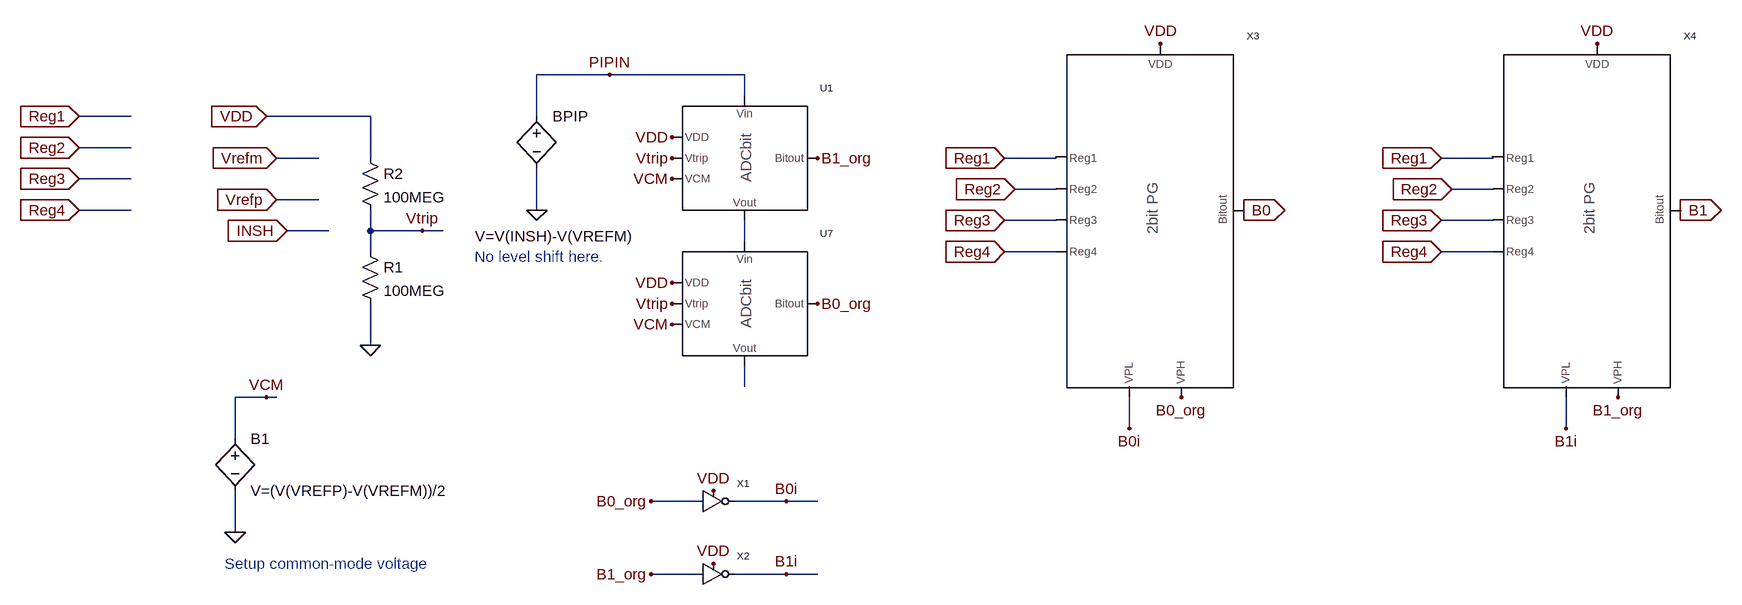
[diagram p0: schematic 2_bit_fine_ADC_LSB.asc]
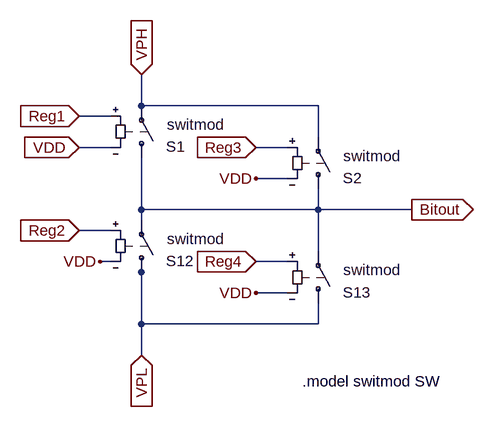
[diagram p1: sub-circuit 2bit_pg.asc]
2_bit_fine_ADC_LSB.asc, the LTspice schematic file:
Version 4
SHEET 1 4400 868
WIRE 800 -1120 688 -1120
WIRE 1008 -1120 800 -1120
WIRE 1008 -1088 1008 -1120
WIRE 64 -1056 -16 -1056
WIRE 432 -1056 272 -1056
WIRE 688 -1056 688 -1120
WIRE 64 -1008 -16 -1008
WIRE 352 -992 288 -992
WIRE 432 -992 432 -1056
WIRE 1488 -992 1408 -992
WIRE 2160 -992 2080 -992
WIRE 64 -960 -16 -960
WIRE 1488 -944 1424 -944
WIRE 2160 -944 2096 -944
WIRE 352 -928 288 -928
WIRE 64 -912 -16 -912
WIRE 688 -912 688 -976
WIRE 1488 -896 1408 -896
WIRE 2160 -896 2080 -896
WIRE 368 -880 304 -880
WIRE 432 -880 432 -912
WIRE 512 -880 432 -880
WIRE 544 -880 512 -880
WIRE 1008 -864 1008 -896
WIRE 432 -848 432 -880
WIRE 1488 -848 1408 -848
WIRE 2160 -848 2080 -848
WIRE 432 -704 432 -768
WIRE 1008 -640 1008 -672
WIRE 272 -624 224 -624
WIRE 288 -624 272 -624
WIRE 1600 -576 1600 -624
WIRE 2272 -576 2272 -624
WIRE 224 -560 224 -624
WIRE 944 -464 864 -464
WIRE 1072 -464 992 -464
WIRE 1120 -464 1072 -464
WIRE 224 -416 224 -480
WIRE 944 -352 864 -352
WIRE 1072 -352 992 -352
WIRE 1120 -352 1072 -352
FLAG 512 -880 Vtrip
FLAG 432 -704 0
FLAG 272 -1056 VDD
IOPIN 272 -1056 In
FLAG 224 -416 0
FLAG 272 -624 VCM
FLAG 688 -912 0
FLAG 896 -992 Vtrip
FLAG 896 -1024 VDD
FLAG 896 -960 VCM
FLAG 896 -768 Vtrip
FLAG 896 -800 VDD
FLAG 896 -736 VCM
FLAG 1120 -768 B0_org
FLAG 800 -1120 PIPIN
FLAG 288 -992 Vrefm
IOPIN 288 -992 In
FLAG 288 -928 Vrefp
IOPIN 288 -928 In
FLAG 1120 -992 B1_org
FLAG 304 -880 INSH
IOPIN 304 -880 In
FLAG -16 -1056 Reg1
IOPIN -16 -1056 In
FLAG -16 -1008 Reg2
IOPIN -16 -1008 In
FLAG -16 -960 Reg3
IOPIN -16 -960 In
FLAG -16 -912 Reg4
IOPIN -16 -912 In
FLAG 864 -464 B0_org
FLAG 960 -480 VDD
FLAG 1072 -464 B0i
FLAG 864 -352 B1_org
FLAG 960 -368 VDD
FLAG 1072 -352 B1i
FLAG 1648 -1168 VDD
FLAG 1408 -992 Reg1
IOPIN 1408 -992 In
FLAG 1424 -944 Reg2
IOPIN 1424 -944 In
FLAG 1408 -896 Reg3
IOPIN 1408 -896 In
FLAG 1408 -848 Reg4
IOPIN 1408 -848 In
FLAG 2320 -1168 VDD
FLAG 1680 -624 B0_org
FLAG 1600 -576 B0i
FLAG 2272 -576 B1i
FLAG 2352 -624 B1_org
FLAG 2448 -912 B1
IOPIN 2448 -912 Out
FLAG 1776 -912 B0
IOPIN 1776 -912 Out
FLAG 2080 -992 Reg1
IOPIN 2080 -992 In
FLAG 2096 -944 Reg2
IOPIN 2096 -944 In
FLAG 2080 -896 Reg3
IOPIN 2080 -896 In
FLAG 2080 -848 Reg4
IOPIN 2080 -848 In
SYMBOL res 416 -864 R0
SYMATTR InstName R1
SYMATTR Value 100MEG
SYMBOL res 416 -1008 R0
SYMATTR InstName R2
SYMATTR Value 100MEG
SYMBOL bv 224 -576 R0
SYMATTR InstName B1
SYMATTR Value V=(V(VREFP)-V(VREFM))/2
SYMBOL bv 688 -1072 R0
WINDOW 3 -95 200 Left 0
SYMATTR Value V=V(INSH)-V(VREFM)
SYMATTR InstName BPIP
SYMBOL ADCbit 864 -976 R0
SYMATTR InstName U1
SYMBOL ADCbit 864 -752 R0
SYMATTR InstName U7
SYMBOL inverter 944 -464 R0
SYMATTR InstName X1
SYMBOL inverter 944 -352 R0
SYMATTR InstName X2
SYMBOL 2bit_pg 1648 -848 R0
SYMATTR InstName X3
SYMBOL 2bit_pg 2320 -848 R0
SYMATTR InstName X4
TEXT 592 -840 Left 0 ;No level shift here.
TEXT 208 -368 Left 0 ;Setup common-mode voltage

2bit_pg.asc, the sub-circuit schematic file:
Version 4
SHEET 1 3216 696
WIRE 864 -1296 864 -1344
WIRE 1136 -1296 864 -1296
WIRE 816 -1280 768 -1280
WIRE 1136 -1248 1136 -1296
WIRE 816 -1232 768 -1232
WIRE 1088 -1232 1040 -1232
WIRE 1088 -1184 1040 -1184
WIRE 864 -1136 864 -1216
WIRE 1136 -1136 1136 -1168
WIRE 1136 -1136 864 -1136
WIRE 1280 -1136 1136 -1136
WIRE 864 -1120 864 -1136
WIRE 816 -1104 768 -1104
WIRE 1136 -1072 1136 -1136
WIRE 816 -1056 800 -1056
WIRE 1088 -1056 1040 -1056
WIRE 864 -1040 864 -1056
WIRE 1088 -1008 1040 -1008
WIRE 864 -960 864 -1040
WIRE 1136 -960 1136 -992
WIRE 1136 -960 864 -960
WIRE 864 -912 864 -960
FLAG 1280 -1136 Bitout
IOPIN 1280 -1136 Out
FLAG 864 -912 VPL
IOPIN 864 -912 In
FLAG 864 -1344 VPH
IOPIN 864 -1344 In
FLAG 768 -1232 VDD
IOPIN 768 -1232 In
FLAG 768 -1280 Reg1
IOPIN 768 -1280 In
FLAG 1040 -1184 VDD
FLAG 1040 -1232 Reg3
IOPIN 1040 -1232 In
FLAG 768 -1104 Reg2
IOPIN 768 -1104 In
FLAG 1040 -1056 Reg4
IOPIN 1040 -1056 In
FLAG 1040 -1008 VDD
FLAG 800 -1056 VDD
SYMBOL sw 864 -1200 M180
WINDOW 3 24 -12 Left 0
WINDOW 38 39 67 Left 0
WINDOW 0 38 33 Left 0
SYMATTR Value ""
SYMATTR SpiceModel switmod
SYMATTR InstName S1
SYMBOL sw 1136 -1152 M180
WINDOW 3 24 -12 Left 0
WINDOW 38 39 67 Left 0
WINDOW 0 38 33 Left 0
SYMATTR Value ""
SYMATTR SpiceModel switmod
SYMATTR InstName S2
SYMBOL sw 864 -1024 M180
WINDOW 3 24 -12 Left 0
WINDOW 38 39 67 Left 0
WINDOW 0 38 33 Left 0
SYMATTR Value ""
SYMATTR SpiceModel switmod
SYMATTR InstName S12
SYMBOL sw 1136 -976 M180
WINDOW 3 24 -12 Left 0
WINDOW 38 39 67 Left 0
WINDOW 0 38 33 Left 0
SYMATTR Value ""
SYMATTR SpiceModel switmod
SYMATTR InstName S13
TEXT 1112 -872 Left 0 !.model switmod SW

The netlist it stands for:
* 2_bit_fine_ADC_LSB.asc
R1 Vtrip 0 100MEG
R2 VDD Vtrip 100MEG
B1 VCM 0 V=(V(VREFP)-V(VREFM))/2
BPIP PIPIN 0 V=V(INSH)-V(VREFM)
XU1 VDD Vtrip VCM PIPIN B1_org N001 ADCbit  ; pins VDD Vtrip VCM Vin Bitout Vout
XU7 VDD Vtrip VCM N001 B0_org N002 ADCbit  ; pins VDD Vtrip VCM Vin Bitout Vout
XX1 B0_org B0i VDD inverter  ; pins In Out VDD
XX2 B1_org B1i VDD inverter  ; pins In Out VDD
XX3 VDD B0i B0 B0_org Reg1 Reg2 Reg3 Reg4 2bit_pg
XX4 VDD B1i B1 B1_org Reg1 Reg2 Reg3 Reg4 2bit_pg

* block symbol definitions
.subckt 2bit_pg VDD VPL Bitout VPH Reg1 Reg2 Reg3 Reg4
S1 Bitout VPH Reg1 VDD switmod
S2 Bitout VPH Reg3 VDD switmod
S12 VPL Bitout Reg2 VDD switmod
S13 VPL Bitout Reg4 VDD switmod
.model switmod SW
.ends 2bit_pg

* No level shift here.
* Setup common-mode voltage
.backanno
.end